# EAGLE design Digital_Praytime_Display_P4.75_v0.9 (EAGLE 9.5.2)

## Sheet 1 of 2
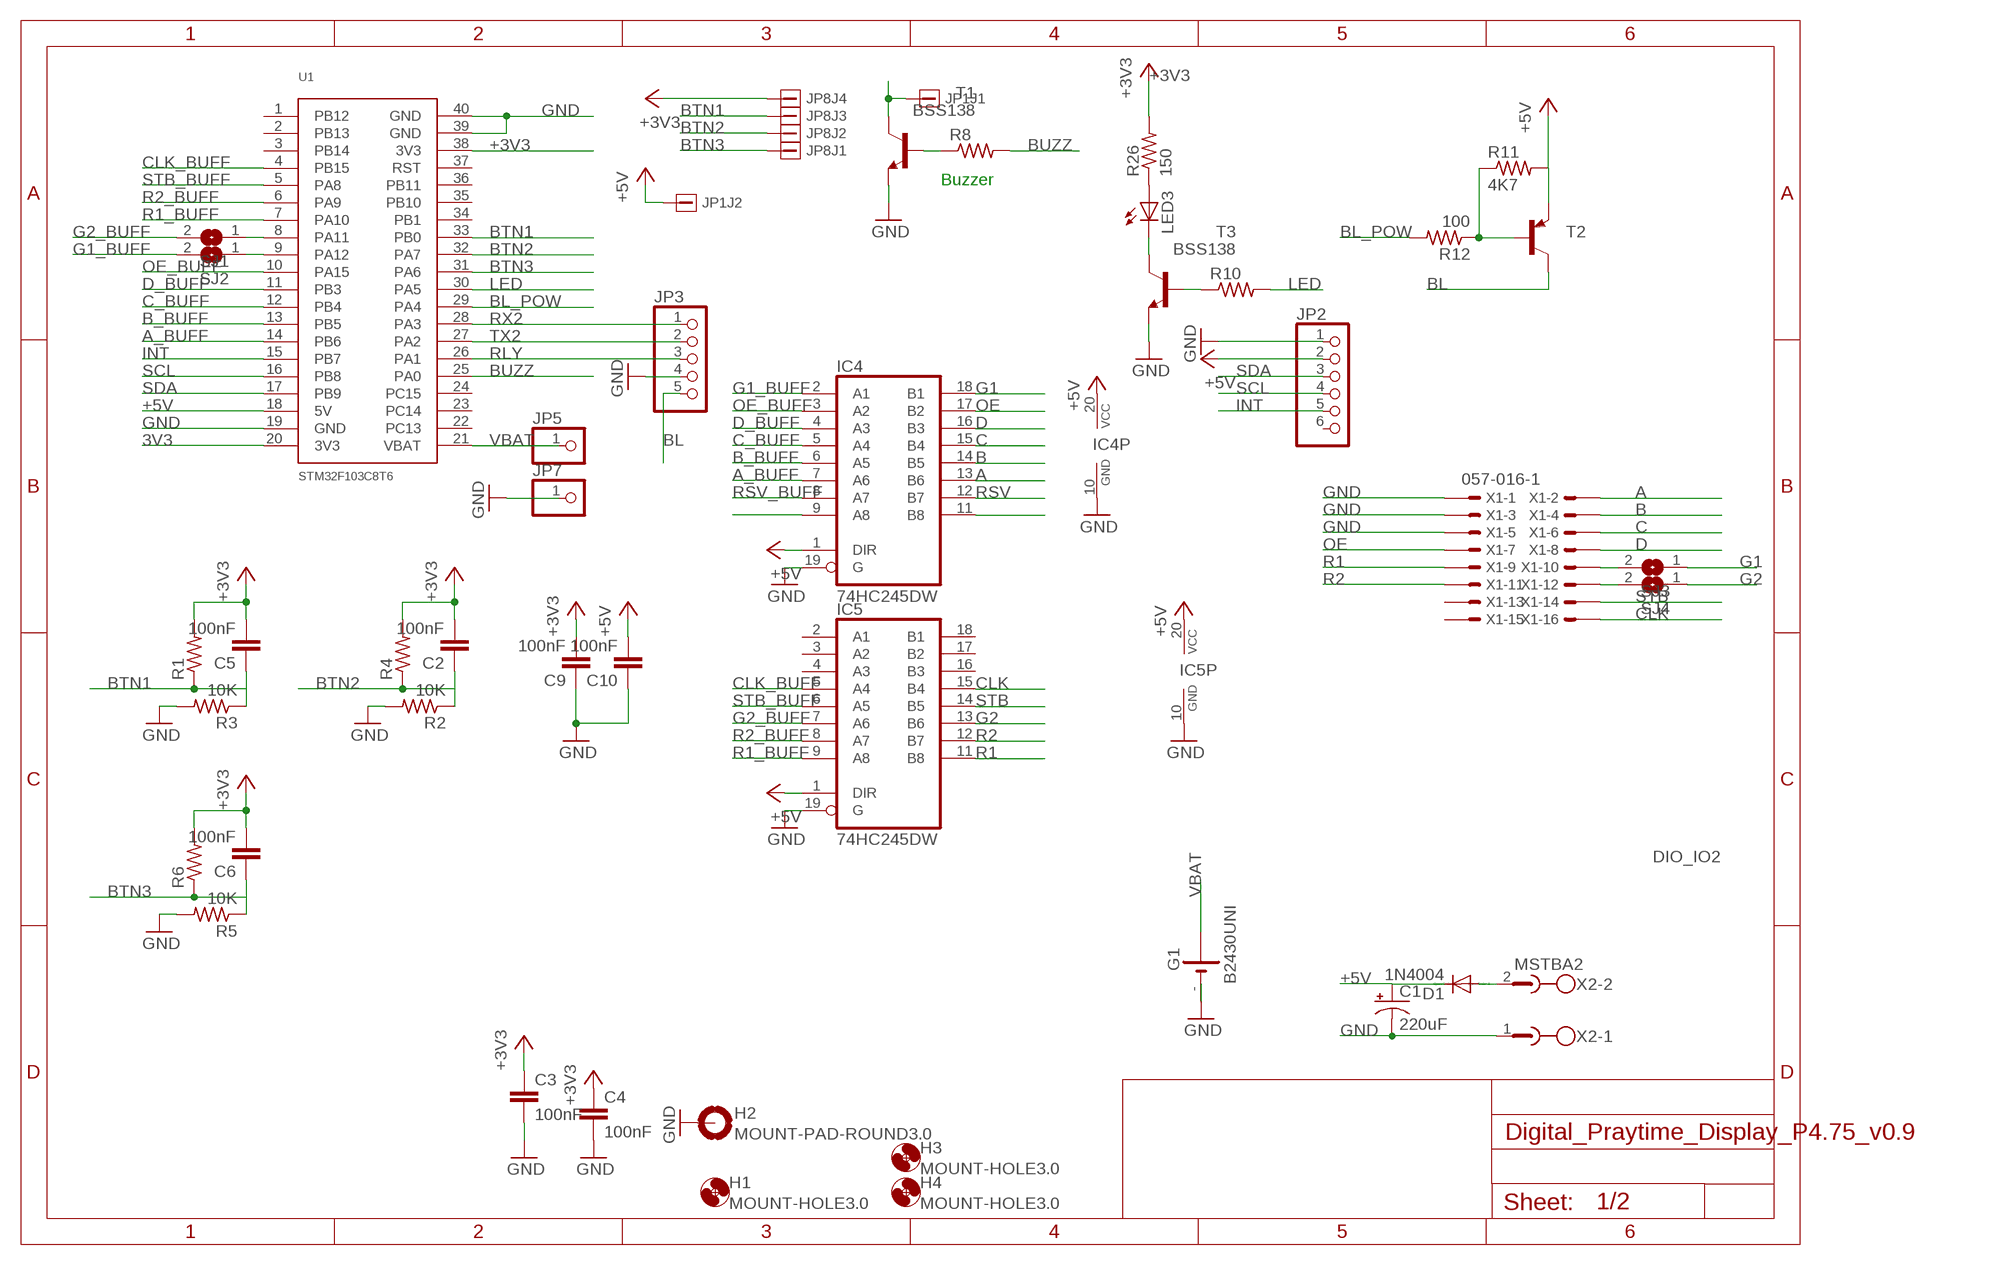
[diagram p0: schematic, sheet 1]

### Parts
C1  220uF  CPOL-USE3.5-8  [E3,5-8]
C2  100nF  C-EUC0805  [C0805]
C3  100nF  C-EUC0805  [C0805]
C4  100nF  C-EUC0805  [C0805]
C5  100nF  C-EUC0805  [C0805]
C6  100nF  C-EUC0805  [C0805]
C9  100nF  C-EUC0805  [C0805]
C10  100nF  C-EUC0805  [C0805]
D1  1N4004  [DO41-10]
G1  B2430UNI  [B2430UNI]
H1  MOUNT-HOLE3.0  [3,0]
H2  MOUNT-PAD-ROUND3.0  [3,0-PAD]
H3  MOUNT-HOLE3.0  [3,0]
H4  MOUNT-HOLE3.0  [3,0]
IC4  74HC245DW  [SO20W]
IC5  74HC245DW  [SO20W]
JP1  CON2-3.81  [CON2-3.81]
JP2  PINHD-1X6  [1X06]
JP3  PINHD-1X5  [1X05]
JP5  PINHD-1X1  [1X01]
JP7  PINHD-1X1  [1X01]
JP8  CON4-3.81  [CON4-3.81]
LED3  LED3MM  [LED3MM]
R1  R-US_0204/2V  [0204V]
R2  10K  R-US_M0805  [M0805]
R3  10K  R-US_M0805  [M0805]
R4  R-US_0204/2V  [0204V]
R5  10K  R-US_M0805  [M0805]
R6  R-US_0204/2V  [0204V]
R8  R-US_R0805  [R0805]
R10  R-US_R0805  [R0805]
R11  4K7  R-US_R0805  [R0805]
R12  100  R-US_R0805  [R0805]
R26  150  R-US_R0805  [R0805]
SJ1  SJ  [SJ]
SJ2  SJ  [SJ]
SJ3  SJ  [SJ]
SJ4  SJ  [SJ]
T1  BSS138  MMBT2222ALT1-NPN-SOT23-BEC  [SOT23-BEC]
T2  -PNP-TO126V  [TO126V]
T3  BSS138  MMBT2222ALT1-NPN-SOT23-BEC  [SOT23-BEC]
U1  STM32F103C8T6  [STM32F103]
X1  057-016-1  [057-016-1]
X2  MSTBA2  [MSTBA2]

### Nets
3V3: U1.20(3V3)
+3V3: C2.2 C3.1 C4.1 C5.2 C6.2 C9.2 JP8.4 R1.2 R4.2 R6.2 R26.2 U1.38(3V3)
+5V: C1.+ C10.2 D1.C IC4.1(DIR) IC4.20(VCC) IC5.1(DIR) IC5.20(VCC) JP1.2 JP2.2 R11.2 T2.1(E) U1.18(5V)
A: IC4.13(B6) X1.2
A_BUFF: IC4.7(A6) U1.14(PB6)
B: IC4.14(B5) X1.4
B_BUFF: IC4.6(A5) U1.13(PB5)
BL: JP3.5 T2.2(C)
BL_POW: R12.2 U1.29(PA4)
BTN1: C5.1 JP8.3 R1.1 R3.1 U1.33(PB0)
BTN2: C2.1 JP8.2 R2.1 R4.1 U1.32(PA7)
BTN3: C6.1 JP8.1 R5.1 R6.1 U1.31(PA6)
BUZZ: R8.2 U1.25(PA0)
C: IC4.15(B4) X1.6
C_BUFF: IC4.5(A4) U1.12(PB4)
CLK: IC5.15(B4) X1.16
CLK_BUFF: IC5.5(A4) U1.4(PB15)
D: IC4.16(B3) X1.8
D_BUFF: IC4.4(A3) U1.11(PB3)
G1: IC4.18(B1) SJ3.1
G1_BUFF: IC4.2(A1) SJ2.2
G2: IC5.13(B6) SJ4.1
G2_BUFF: IC5.7(A6) SJ1.2
GND: C1.- C3.2 C4.2 C9.1 C10.1 G1.- G1.-@1(-) H2.B3,0(MOUNT) IC4.10(GND) IC4.19(G) IC5.10(GND) IC5.19(G) JP2.1 JP3.4 JP7.1 R2.2 R3.2 R5.2 T1.E T3.E U1.19(GND) U1.39(GND) U1.40(GND) X1.1 X1.3 X1.5 X2.1
INT: JP2.5 U1.15(PB7)
LED: R10.2 U1.30(PA5)
N$1: R11.1 R12.1 T2.3(B)
N$2: IC4.9(A8)
N$3: LED3.K(C) T3.C
N$4: R10.1 T3.B
N$5: R8.1 T1.B
N$6: JP1.1 T1.C
N$9: IC4.11(B8)
N$12: SJ1.1 U1.8(PA11)
N$13: SJ2.1 U1.9(PA12)
N$14: SJ4.2 X1.12
N$15: SJ3.2 X1.10
N$29: LED3.A R26.1
N$41: D1.A X2.2
OE: IC4.17(B2) X1.7
OE_BUFF: IC4.3(A2) U1.10(PA15)
R1: IC5.11(B8) X1.9
R1_BUFF: IC5.9(A8) U1.7(PA10)
R2: IC5.12(B7) X1.11
R2_BUFF: IC5.8(A7) U1.6(PA9)
RLY: JP3.3 U1.26(PA1)
RSV: IC4.12(B7)
RSV_BUFF: IC4.8(A7)
RX2: JP3.1 U1.28(PA3)
SCL: JP2.4 U1.16(PB8)
SDA: JP2.3 U1.17(PB9)
STB: IC5.14(B5) X1.14
STB_BUFF: IC5.6(A5) U1.5(PA8)
TX2: JP3.2 U1.27(PA2)
VBAT: G1.+@4(+) JP5.1 U1.21(VBAT)
Unconnected: IC5.2(A1) IC5.3(A2) IC5.4(A3) IC5.16(B3) IC5.17(B2) IC5.18(B1) JP2.6 U1.1(PB12) U1.2(PB13) U1.3(PB14) U1.22(PC13) U1.23(PC14) U1.24(PC15) U1.34(PB1) U1.35(PB10) U1.36(PB11) U1.37(RST) X1.13 X1.15

### Notes on the sheet
- Buzzer

## Sheet 2 of 2
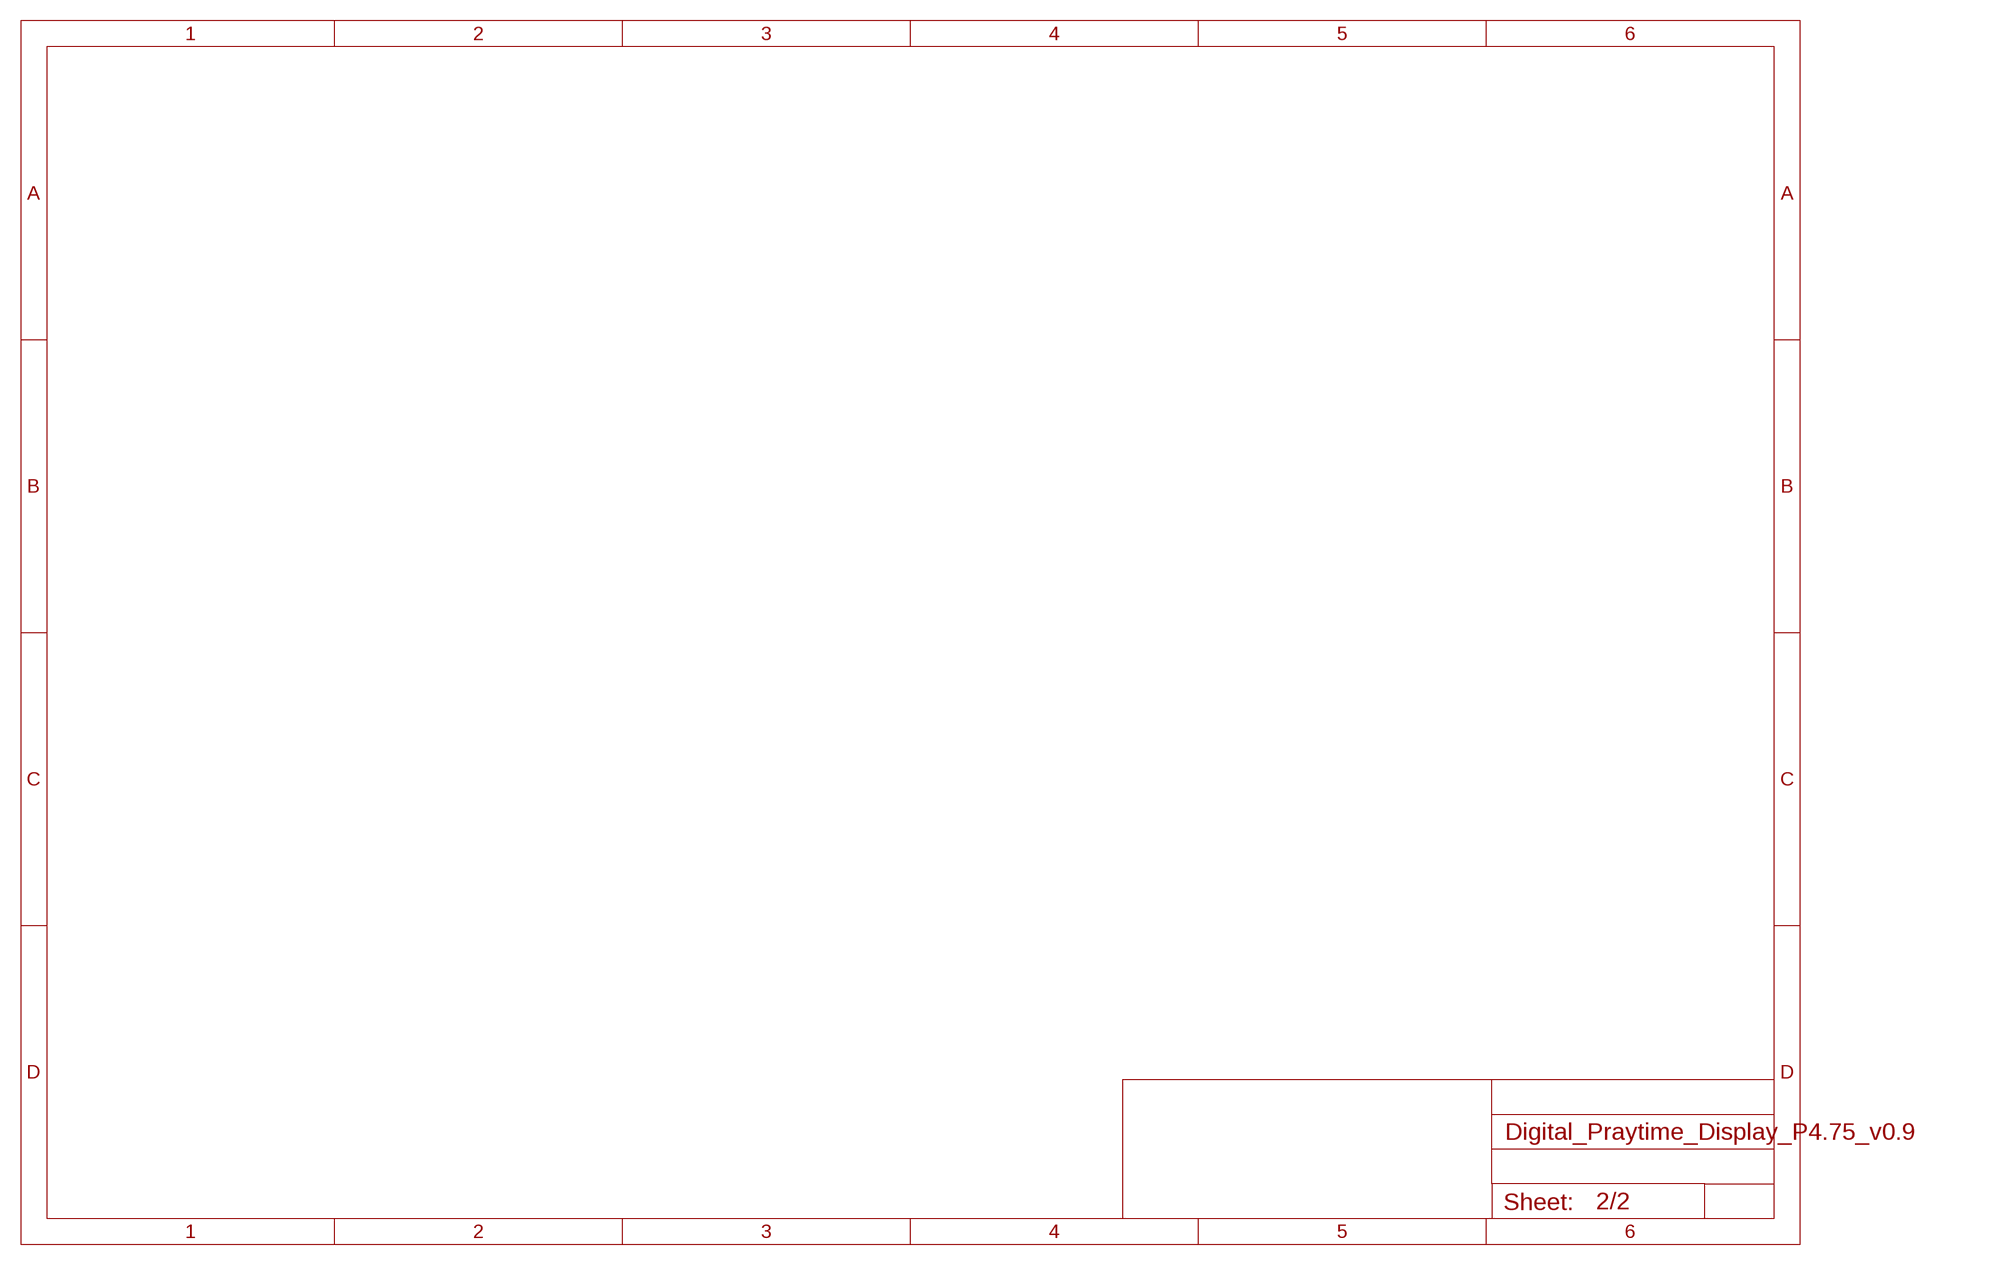
[diagram p1: schematic, sheet 2]

## Library data of the parts
C1 = rcl:CPOL-US: POLARIZED CAPACITOR, American symbol
C2 C5 C6 C9 C10 = resistor:C-EU: CAPACITOR, European symbol
C3 C4 = rcl:C-EU: CAPACITOR, European symbol
D1 = diode:1N4004: DIODE general purpose rectifier, 1 A
G1 = battery:B2430UNI: LI BATTERY
H1 H3 H4 = holes:MOUNT-HOLE: MOUNTING HOLE with drill center marker
H2 = holes:MOUNT-PAD-ROUND: MOUNTING PAD, round
IC4 IC5 = 74xx-eu:74*245: Octal BUS TRANSCEIVER, 3-state
JP1 = IyunLib:CON2-3.81
JP2 = pinhead:PINHD-1X6: PIN HEADER
JP3 = pinhead:PINHD-1X5: PIN HEADER
JP5 JP7 = pinhead:PINHD-1X1: PIN HEADER
JP8 = IyunLib:CON4-3.81
LED3 = led:LED: LED OSRAM: - CHIPLED LG R971, LG N971, LY N971, LG Q971, LY Q971, LO R971, LY R971 LH N974, LH R974 LS Q976, LO Q976, LY Q976 LO Q996 - Hyper CHIPLED LW Q18S LB Q993, LB Q99A, LB R99A - SideLED LS A670, LO A670, LY A670, LG A670, LP A670 LB A673, LV A673, LT A673, LW A673 LH A674 LY A675 LS A676, LA A676, LO A676, LY A676, LW A676 LS A679, LY A679, LG A679 - Hyper Micro SIDELED® LS Y876, LA Y876, LO Y876, LY Y876 LT Y87S - SmartLED LW L88C, LW L88S LB L89C, LB L89S, LG L890 LS L89K, LO L89K, LY L89K LS L896, LA L896, LO L896, LY L896 - TOPLED LS T670, LO T670, LY T670, LG T670, LP T670 LSG T670, LSP T670, LSY T670, LOP T670, LYG T670 LG T671, LOG T671, LSG T671 LB T673, LV T673, LT T673, LW T673 LH T674 LS T676, LA T676, LO T676, LY T676, LB T676, LH T676, LSB T676, LW T676 LB T67C, LV T67C, LT T67C, LS T67K, LO T67K, LY T67K, LW E67C LS E67B, LA E67B, LO E67B, LY E67B, LB E67C, LV E67C, LT E67C LW T67C LS T679, LY T679, LG T679 LS T770, LO T770, LY T770, LG T770, LP T770 LB T773, LV T773, LT T773, LW T773 LH T774 LS E675, LA E675, LY E675, LS T675 LS T776, LA T776, LO T776, LY T776, LB T776 LHGB T686 LT T68C, LB T68C - Hyper Mini TOPLED® LB M676 - Mini TOPLED Santana® LG M470 LS M47K, LO M47K, LY M47K Source: http://www.osram.convergy.de LUXEON: - LUMILED® LXK2-PW12-R00, LXK2-PW12-S00, LXK2-PW14-U00, LXK2-PW14-V00 LXK2-PM12-R00, LXK2-PM12-S00, LXK2-PM14-U00 LXK2-PE12-Q00, LXK2-PE12-R00, LXK2-PE12-S00, LXK2-PE14-T00, LXK2-PE14-U00 LXK2-PB12-K00, LXK2-PB12-L00, LXK2-PB12-M00, LXK2-PB14-N00, LXK2-PB14-P00, LXK2-PB14-Q00 LXK2-PR12-L00, LXK2-PR12-M00, LXK2-PR14-Q00, LXK2-PR14-R00 LXK2-PD12-Q00, LXK2-PD12-R00, LXK2-PD12-S00 LXK2-PH12-R00, LXK2-PH12-S00 LXK2-PL12-P00, LXK2-PL12-Q00, LXK2-PL12-R00 Source: www.luxeon.com KINGBRIGHT: KA-3528ASYC Source: www.kingbright.com
R1 R4 R6 = rcl:R-US_: RESISTOR, American symbol; SPICEPREFIX: R
R2 R3 R5 R8 R10-R12 R26 = rcl:R-US_: RESISTOR, American symbol
SJ1-SJ4 = jumper:SJ: SMD solder JUMPER
T1 T3 = transistor:*-NPN-: NPN Transistror BF959 corrected 2008.03.06
T2 = transistor:*-PNP-: PNP Transistror
U1 = IyunLib:STM32F103C8T6
X1 = con-panduit:057-016-: CONNECTOR 10-pin series 057 contact pc board low profile headers; OC_FARNELL: unknown; OC_NEWARK: unknown
X2 = con-phoenix-508:MSTBA2: PHOENIX; MF: FARNELL; MPN: 1757242; OC_FARNELL: 3705171; OC_NEWARK: 71C4161

## Board
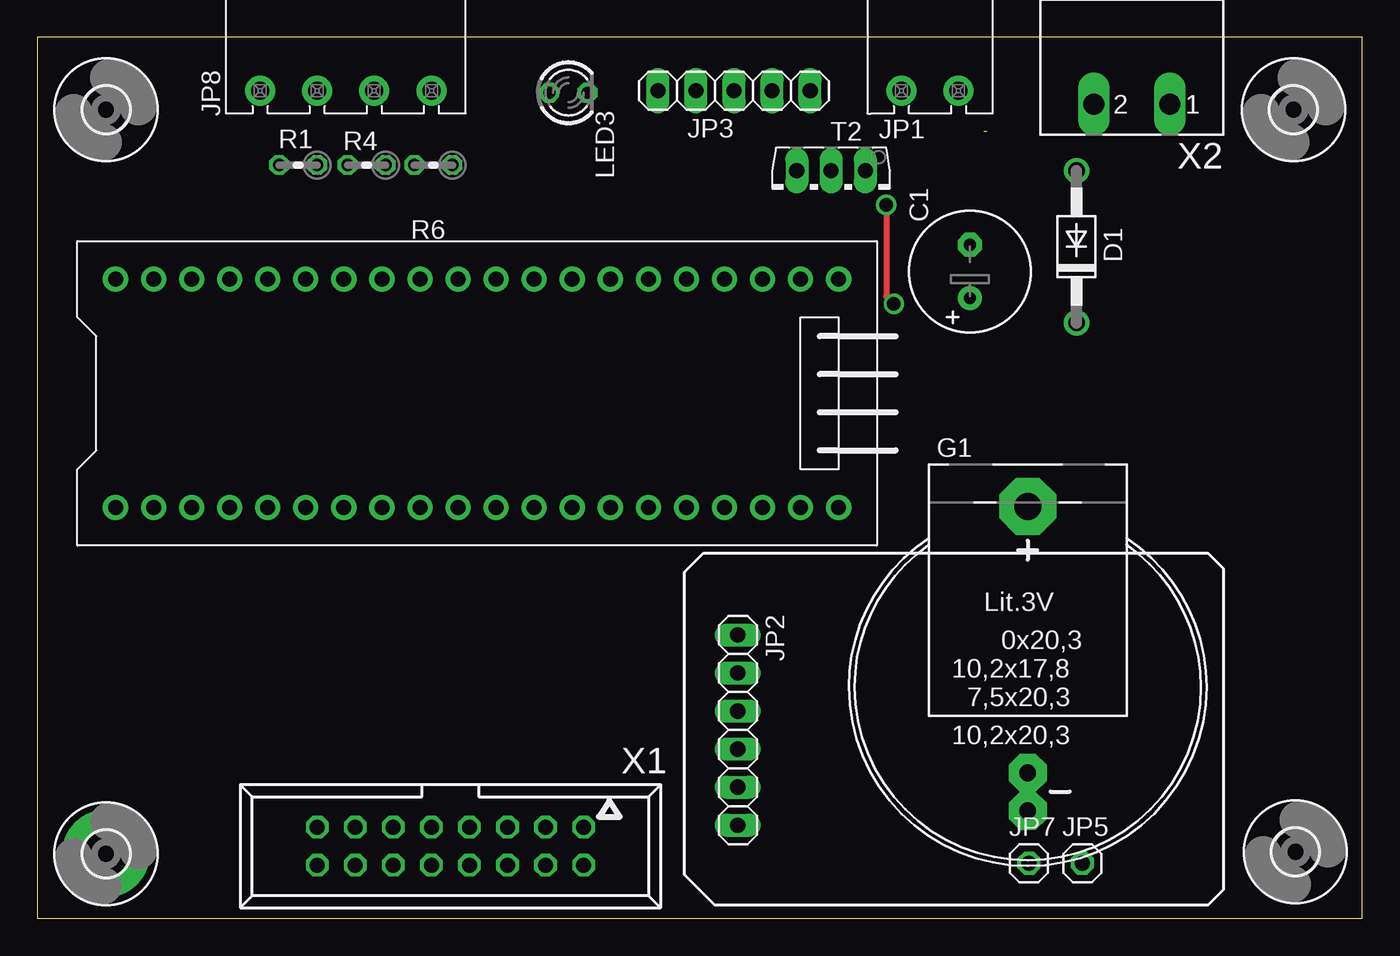
[diagram p2: board, top side]
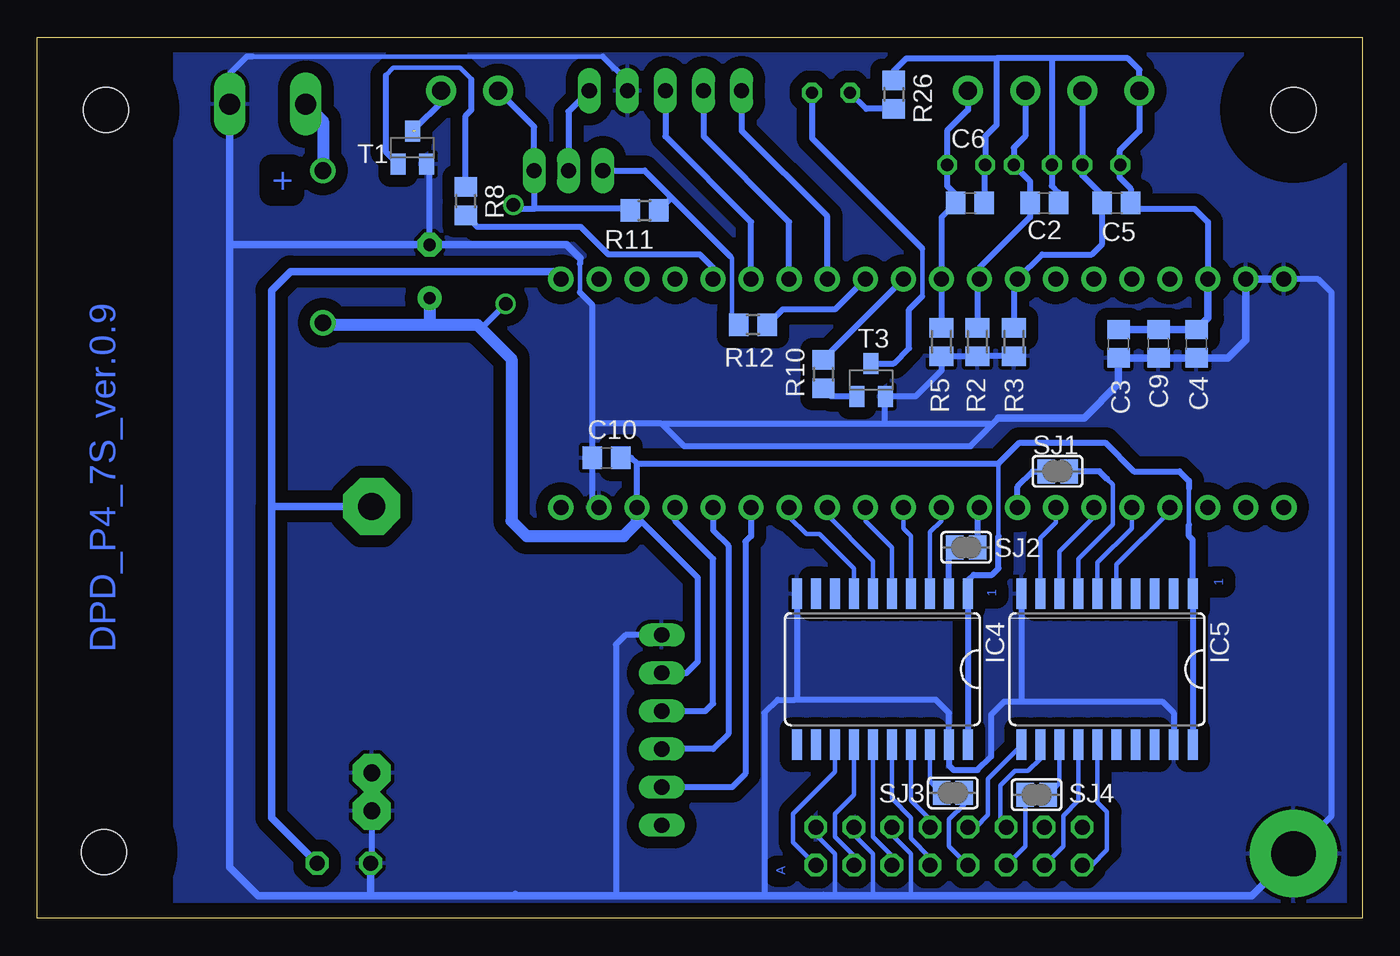
[diagram p3: board, bottom side, seen from below]

Size 88.39 x 58.8 mm. Coordinates in mm from the lower left corner, seen from the top.
Outline: 0,0 88.39,0 88.39,58.8 0,58.8 0,0
Copper layers (1*16): Top 0.035mm / dielectric 1.5mm / Bottom 0.035mm
Design rules "default": minimum track width 10mil, minimum drill 24mil, track to track 8mil, track to pad 8mil, pad to pad 8mil, via to via 8mil, smd to smd 8mil, copper to edge 40mil, drill to drill 8mil, minimum pad ring 10mil, minimum via ring 8mil, stop-mask expansion 4mil, vias tented up to drill 0mil, thermal gap 10mil

### Footprints (pad centres in the part's own frame; a part is rotated, then mirrored left to right if it is on the bottom)
E3,5-8 = drill 0.813 pad 1.6: + -1.778,0 | drill 0.813 pad 1.6 octagon: - 1.778,0
C0805 = smd 1.3 x 1.5: 1 -0.95,0; 2 0.95,0
DO41-10 = drill 1.118: A 5.08,0; C -5.08,0
B2430UNI = drill 1.803 pad 3.81 octagon: +@4 0,12.065 | drill 1.118 pad 2.54 octagon: - 0,-5.715; -@1 0,-8.255
3,0 = hole 3: 0,0
3,0-PAD = drill 3 pad 5.842: B3,0 0,0
SO20W = smd 0.66 x 2.032: 1 -5.715,-5.029; 2 -4.445,-5.029; 3 -3.175,-5.029; 4 -1.905,-5.029; 5 -0.635,-5.029; 6 0.635,-5.029; 7 1.905,-5.029; 8 3.175,-5.029; 9 4.445,-5.029; 10 5.715,-5.029; 11 5.715,5.029; 12 4.445,5.029; 13 3.175,5.029; 14 1.905,5.029; 15 0.635,5.029; 16 -0.635,5.029; 17 -1.905,5.029; 18 -3.175,5.029; 19 -4.445,5.029; 20 -5.715,5.029
CON2-3.81 = drill 1.2 pad 2: 1 -2.54,0; 2 1.27,0
1X06 = drill 1.016 long: 1 -6.35,0; 2 -3.81,0; 3 -1.27,0; 4 1.27,0; 5 3.81,0; 6 6.35,0
1X05 = drill 1.016 long: 1 -5.08,0; 2 -2.54,0; 3 0,0; 4 2.54,0; 5 5.08,0
1X01 = drill 1.016 octagon: 1 0,0
CON4-3.81 = drill 1.2 pad 2: 1 -5.08,0; 2 -1.27,0; 3 2.54,0; 4 6.35,0
LED3MM = drill 0.813 octagon: A -1.27,0; K 1.27,0
0204V = drill 0.813 octagon: 1 -1.27,0; 2 1.27,0
M0805 = smd 1.3 x 1.6: 1 -0.95,0; 2 0.95,0
R0805 = smd 1.3 x 1.5: 1 -0.95,0; 2 0.95,0
SJ = smd 1.168 x 1.6: 1 -0.762,0; 2 0.762,0
SOT23-BEC = smd 1 x 1.4: B -0.95,-1.1; C 0,1.1; E 0.95,-1.1
TO126V = drill 1.016 long: 1 -2.286,-1.27; 2 0,-1.27; 3 2.286,-1.27
STM32F103 = drill 1 pad 1.676: 1 -7.62,24.13; 2 -7.62,21.59; 3 -7.62,19.05; 4 -7.62,16.51; 5 -7.62,13.97; 6 -7.62,11.43; 7 -7.62,8.89; 8 -7.62,6.35; 9 -7.62,3.81; 10 -7.62,1.27; 11 -7.62,-1.27; 12 -7.62,-3.81; 13 -7.62,-6.35; 14 -7.62,-8.89; 15 -7.62,-11.43; 16 -7.62,-13.97; 17 -7.62,-16.51; 18 -7.62,-19.05; 19 -7.62,-21.59; 20 -7.62,-24.13; 21 7.62,-24.13; 22 7.62,-21.59; 23 7.62,-19.05; 24 7.62,-16.51; 25 7.62,-13.97; 26 7.62,-11.43; 27 7.62,-8.89; 28 7.62,-6.35; 29 7.62,-3.81; 30 7.62,-1.27; 31 7.62,1.27; 32 7.62,3.81; 33 7.62,6.35; 34 7.62,8.89; 35 7.62,11.43; 36 7.62,13.97; 37 7.62,16.51; 38 7.62,19.05; 39 7.62,21.59; 40 7.62,24.13
057-016-1 = drill 1 octagon: 1 -8.89,-1.27; 2 -8.89,1.27; 3 -6.35,-1.27; 4 -6.35,1.27; 5 -3.81,-1.27; 6 -3.81,1.27; 7 -1.27,-1.27; 8 -1.27,1.27; 9 1.27,-1.27; 10 1.27,1.27; 11 3.81,-1.27; 12 3.81,1.27; 13 6.35,-1.27; 14 6.35,1.27; 15 8.89,-1.27; 16 8.89,1.27
MSTBA2 = drill 1.397 long: 1 -2.54,5.08; 2 2.54,5.08

### Placement (x,y rotation side)
C1  62.23,43.18 90 top
C2  21.21,47.75 0 bottom
C3  16.26,38.35 270 bottom
C4  11.05,38.35 270 bottom
C5  16.38,47.75 0 bottom
C6  26.16,47.75 0 bottom
C9  13.59,38.35 90 bottom
C10  50.42,30.73 0 bottom
D1  69.34,44.83 90 top
G1  66.08,15.44 0 top
H1  83.95,4.45 0 top
H2  4.57,4.32 0 top
H3  83.82,53.98 0 top
H4  4.57,53.98 0 top
IC4  32,16.64 180 bottom
IC5  17.02,16.64 180 bottom
JP1  58.93,55.24 180 top
JP2  46.74,12.57 270 top
JP3  46.48,55.24 0 top
JP5  69.72,3.68 0 top
JP7  66.17,3.68 0 top
JP8  21.21,55.24 180 top
LED3  35.43,55.12 0 top
R1  17.4,50.29 180 top
R2  25.65,38.48 270 bottom
R3  23.24,38.48 270 bottom
R4  21.97,50.29 180 top
R5  28.07,38.48 270 bottom
R6  26.42,50.29 180 top
R8  59.82,47.88 270 bottom
R10  35.94,36.32 90 bottom
R11  47.88,47.24 180 bottom
R12  40.64,39.62 0 bottom
R26  31.24,54.99 90 bottom
SJ1  20.32,29.84 0 bottom
SJ2  26.42,24.77 180 bottom
SJ3  27.3,8.38 0 bottom
SJ4  21.72,8.25 180 bottom
T1  63.37,51.44 0 bottom
T2  52.96,48.64 180 top
T3  32.77,35.94 0 bottom
U1  29.34,35.05 90 top
X1  27.56,4.83 180 top
X2  73.02,59.44 180 top

### Tracks (layer width: path | path; a pad name or v marks a point on that pad's centre or on a via)
+3V3
  Bottom 0.406: C5.2 15.43,47.43 | C5.2 15.43,48.71 16.2,49.47 16.2,50.23 R1.2 16.2,50.36 16.2,51.24 14.86,52.58 JP8.4 14.86,56.64 15.62,57.4 20.7,57.4 | C6.2 25.21,50.23 R6.2 25.15,52.2 24.38,52.96 24.38,57.4 | C2.2 20.26,48.45 20.7,48.89 R4.2 20.7,57.4 | C3.1 16.58,39.62 | 20.7,57.4 24.38,57.4 | 24.38,57.4 30.41,57.4 31.24,56.58 R26.2 | 10.29,42.8 U1.38 10.29,42.93 10.29,46.48 11.18,47.37 15.05,47.37 C5.2
  Bottom 0.508: 10.61,39.3 C4.1 | C9.2 13.97,39.3 | C4.1 C9.2 | C9.2 C3.1 | C4.1 10.29,40.07 10.29,42.93
+5V  (via drill 0.9)
  Top 0.406: v56.64,47.62 56.64,41.53 v57.15,41.02
  Bottom 0.305: 24.26,25.53 24.26,30.35 | 11.56,26.29 11.56,28.7
  Bottom 0.406: IC4.20 IC4.1 26.29,22.55 25.91,22.94 24.69,22.94 24.26,23.37 24.26,25.53 | IC5.20 IC5.1 11.3,25.27 11.56,25.53 11.56,26.29 | 59.05,39.62 58.86,39.43 | 66.04,39.75 65.91,39.62 | 48.39,30.35 24.26,30.35 22.86,31.75 17.14,31.75 15.24,29.84 12.19,29.84 11.56,29.21 11.56,28.7 | R11.2 48.96,47.37 55.24,47.37 | v56.64,47.62 56.39,47.37 55.24,47.37 | 55.24,47.37 T2.1 55.24,52.83 JP1.2 | v57.15,41.02 58.74,39.43 58.74,39.31 | JP2.2 45.08,16.38 44.32,17.14 44.32,22.73 48.39,26.8 U1.18 48.39,30.35 | C10.2 48.77,30.73 48.39,30.35
  Bottom 0.813: 62.23,39.62 59.05,39.62 58.74,39.31 56.77,37.34 56.77,26.54 55.75,25.53 49.28,25.53 48.39,26.42 U1.18 | D1.C 69.22,39.62 65.91,39.62 62.23,39.62 | C1.+ 62.23,39.62
A
  Bottom 0.305: IC4.13 35.18,9.78 37.97,6.98 37.97,5.08 X1.2
A_BUFF
  Bottom 0.305: U1.14 38.23,26.8 37.08,25.65 36.19,25.65 33.91,23.37 IC4.7
B
  Bottom 0.305: IC4.14 33.91,8.25 35.18,6.98 35.18,5.46 33.91,4.19 X1.4
B_BUFF
  Bottom 0.305: U1.13 35.69,26.92 32.64,23.88 IC4.6
BL
  Bottom 0.406: JP3.5 52.96,53.85 T2.2
BL_POW
  Bottom 0.406: U1.29 35.18,40.64 38.67,40.64 R12.2
BTN1
  Bottom 0.406: JP8.3 R1.1 18.67,49.6 17.33,48.26 C5.1 17.33,45.02 18.03,44.32 21.34,44.32 U1.33 23.24,42.42 R3.1
BTN2
  Bottom 0.406: C2.1 22.16,49.21 R4.1 23.24,51.44 22.48,52.2 JP8.2 | 22.48,47.75 C2.1 | C2.1 21.91,47.5 | C2.1 22.16,46.8 25.53,43.43 U1.32 25.65,42.55 R2.1
BTN3
  Bottom 0.406: JP8.1 26.29,53.98 27.69,52.58 R6.1 27.69,48.89 27.11,48.32 C6.1 28.07,46.8 U1.31 R5.1
BUZZ
  Bottom 0.406: U1.25 43.31,43.43 44.2,44.32 50.29,44.32 52.14,46.17 59.05,46.17 R8.2
C
  Bottom 0.305: IC4.15 32.64,5.46 31.37,4.19 X1.6
C_BUFF
  Bottom 0.305: U1.12 33.15,26.54 31.37,24.77 IC4.5
CLK
  Bottom 0.305: IC5.15 17.65,7.75 17.02,7.11 17.02,4.57 18.03,3.56 X1.16
CLK_BUFF
  Bottom 0.305: U1.4 12.83,27.18 16.38,23.62 IC5.5
D
  Bottom 0.305: IC4.16 31.37,8 30.1,6.73 30.1,5.33 28.83,4.06 X1.8
D_BUFF
  Bottom 0.305: U1.11 30.61,26.04 30.1,25.53 IC4.4
G1
  Bottom 0.305: SJ3.1 28.83,9.14 IC4.18
G1_BUFF
  Bottom 0.406: IC4.2 27.56,24.38 SJ2.2
G2
  Bottom 0.305: IC5.13 20.19,9.02 SJ4.1
G2_BUFF
  Bottom 0.305: IC5.7 18.92,24 16.64,26.29 16.64,28.96 17.02,29.34
  Bottom 0.406: 17.02,29.34 17.53,29.84 SJ1.2
GND
  Bottom 0.305: 52.2,41.78 52.2,43.69 | 35.94,1.65 35.81,1.52 | X1.5 31.37,5.59 30.1,4.32 30.1,1.52 | X1.3 33.91,5.59 32.64,4.32 32.64,1.52 | X1.1 36.45,5.59 35.18,4.32 35.18,1.65 35.31,1.52 | 50.67,57.53 74.04,57.53
  Bottom 0.406: 52.2,44.07 52.2,43.69 | U1.19 51.37,27.87 C10.1 51.37,33.02 | 52.2,41.78 51.37,40.95 51.37,33.02 | IC5.19 12.57,13.72 13.34,14.48 22.61,14.48 | 22.61,14.48 23.88,14.48 24.77,13.59 24.77,10.79 25.65,9.91 27.25,9.91 27.56,10.21 IC4.19 27.56,13.72 28.45,14.6 37.85,14.6 | 22.73,21.97 IC5.10 22.73,14.6 22.61,14.48 | 46.74,33.02 51.37,33.02 | 37.85,14.6 38.99,14.6 39.88,13.72 39.88,1.52 | R3.2 R2.2 R5.2 28.07,36.58 29.8,34.84 T3.E 31.88,34.78 31.88,33.02 | 4.95,42.67 2.92,42.67 2.03,41.78 2.03,6.86 5.33,3.56 | 4.95,42.67 U1.40 | 4.83,42.8 4.95,42.67 | IC4.10 37.72,14.73 37.85,14.6 | 46.74,33.02 45.24,31.53 26.13,31.53 24.64,33.02 | 56.51,1.65 56.39,1.52 | 46.74,33.02 31.88,33.02 | 31.88,33.02 24.64,33.02 | 24.64,33.02 24.26,33.4 | G1.- G1.-@1 66.08,3.77 JP7.1 66.29,3.68 | C1.- 62.23,50.14 T1.E | JP3.4 49.02,55.88 50.67,57.53 | 74.04,57.53 74.42,57.53 75.56,56.39 75.56,54.1 | JP2.1 49.15,18.92 49.78,18.29 49.78,1.52
  Bottom 0.508: 52.2,44.07 53.09,44.96 C1.- 75.56,44.96 | 66.17,1.52 73.66,1.52 75.56,3.43 75.56,44.96 | 66.17,1.52 56.39,1.52 49.78,1.52 42.21,1.52 | 42.08,1.52 39.88,1.52 35.81,1.52 35.31,1.52 32.64,1.52 30.1,1.52 7.37,1.52 5.33,3.56 H2.B3,0 | U1.40 U1.39 | U1.39 7.94,42.48 | X2.1 75.56,54.1 75.56,44.96 | JP7.1 66.17,1.52 | U1.39 7.75,38.61 8.95,37.4 C4.2 C9.1 C3.2 16.26,35.69 18.54,33.4 24.26,33.4
  pour Bottom (isolate 0.813): 0.38,58.55 79.25,58.55 79.25,0.13 0.38,0.13
INT
  Bottom 0.406: U1.15 40.77,25.53 41.15,25.15 41.15,9.65 42.04,8.76 JP2.5
LED
  Bottom 0.305: 35.75,37.27 R10.2
  Bottom 0.406: U1.30 35.75,37.53 35.75,37.27
N$1
  Bottom 0.305: R12.1 42.04,40.07 42.04,44.07 42.16,44.2
  Bottom 0.406: 42.16,44.2 46.16,48.2 | 46.16,48.2 47.88,49.91 T2.3 | R11.1 46.16,48.01 46.16,48.2
N$3
  Bottom 0.305: 29.34,44.7 29.34,41.53
  Bottom 0.406: 32.77,36.83 T3.C 31.24,37.04 30.23,38.06 30.23,40.64 29.34,41.53 | LED3.K 36.7,52.07 29.34,44.7
N$4
  Bottom 0.406: T3.B 35.41,34.84 R10.1
N$5
  Bottom 0.305: 59.44,56.01 60.2,56.77 64.64,56.77 65.15,56.26
  Bottom 0.406: 59.44,56.01 59.44,53.98 59.82,53.59 R8.1 | T1.B 65.15,51.16 65.15,56.26
N$6  (1 unrouted)
  Bottom 0.406: JP1.1 61.47,54.44 63.14,52.76 63.14,52.53
N$12
  Bottom 0.406: U1.8 22.99,28.83 21.97,29.84 SJ1.1
N$13
  Bottom 0.406: U1.9 25.65,27.3 SJ2.1
N$14
  Bottom 0.305: X1.12 22.48,4.83 SJ4.2
N$15
  Bottom 0.305: X1.10 27.56,4.83 27.56,6.6 26.54,7.62 SJ3.2
N$29
  Bottom 0.406: R26.1 33.09,54.04 LED3.A
N$41
  Bottom 0.813: X2.2 69.34,53.21 D1.A
OE
  Bottom 0.305: 28.83,6.48 X1.7 28.83,6.6 30.1,7.87 IC4.17
OE_BUFF
  Bottom 0.305: U1.10 28.07,26.54 28.83,25.78 IC4.3
R1
  Bottom 0.305: IC5.11 22.73,11.56 24.96,9.33 24.96,6.92 25.78,6.1 X1.9
R1_BUFF
  Bottom 0.305: U1.7 20.45,26.42 21.46,25.4 IC5.9
R2
  Bottom 0.305: X1.11 24.13,6.48 24.13,8.89 23.18,9.84 22.29,9.84 21.46,10.67 IC5.12
R2_BUFF
  Bottom 0.305: U1.6 17.91,26.8 20.19,24.51 IC5.8
RLY
  Bottom 0.406: U1.26 40.77,46.48 46.48,52.2 JP3.3
RX2
  Bottom 0.406: U1.28 35.69,46.86 41.4,52.58 JP3.1
SCL
  Bottom 0.406: U1.16 43.31,25.91 42.29,24.89 42.29,12.32 43.31,11.3 JP2.4
SDA
  Bottom 0.406: JP2.3 43.81,13.84 43.31,14.35 43.31,24 45.85,26.54 U1.17
STB
  Bottom 0.305: IC5.14 18.92,7.87 19.94,6.86 19.94,4.83 X1.14
STB_BUFF
  Bottom 0.305: U1.5 15.37,26.04 17.65,23.75 IC5.6
TX2
  Bottom 0.406: U1.27 38.23,46.48 43.94,52.2 JP3.2
VBAT
  Bottom 0.508: U1.21 53.97,43.18 71.5,43.18 72.77,41.91 72.77,27.43 | 72.77,27.43 72.77,6.73 JP5.1 | G1.+@4 72.7,27.51 72.77,27.43

### Text on the board
Bottom: + | 1 | 1 | DPD_P4_7S_ver.0.9 | A